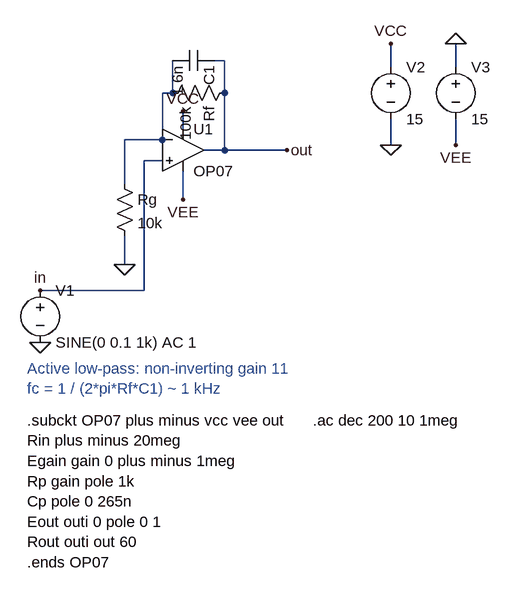
[diagram p0: schematic active_lowpass.asc]
active_lowpass.asc, the LTspice schematic file:
Version 4
SHEET 1 880 760
WIRE 80 480 240 480
WIRE 240 480 240 280
WIRE 240 280 268 280
WIRE 268 248 210 248
WIRE 210 248 210 316
WIRE 210 396 210 440
WIRE 268 248 268 176
WIRE 268 176 284 176
WIRE 284 126 284 176
WIRE 348 126 364 126
WIRE 364 126 364 176
WIRE 364 176 364 264
WIRE 332 264 364 264
WIRE 364 264 460 264
WIRE 300 232 300 204
WIRE 300 296 300 340
WIRE 620 136 620 100
WIRE 620 216 620 256
WIRE 720 136 720 100
WIRE 720 216 720 256
FLAG 80 560 0
FLAG 210 440 0
FLAG 80 480 in
FLAG 460 264 out
FLAG 300 204 VCC
FLAG 300 340 VEE
FLAG 620 100 VCC
FLAG 620 256 0
FLAG 720 100 0
FLAG 720 256 VEE
SYMBOL OpAmps\OP07 300 200 R0
SYMATTR InstName U1
SYMATTR Value OP07
SYMBOL voltage 80 464 R0
SYMATTR InstName V1
SYMATTR Value SINE(0 0.1 1k) AC 1
SYMBOL voltage 620 120 R0
SYMATTR InstName V2
SYMATTR Value 15
SYMBOL voltage 720 120 R0
SYMATTR InstName V3
SYMATTR Value 15
SYMBOL res 380 160 R90
SYMATTR InstName Rf
SYMATTR Value 100k
SYMBOL res 194 300 R0
SYMATTR InstName Rg
SYMATTR Value 10k
SYMBOL cap 348 110 R90
SYMATTR InstName C1
SYMATTR Value 1.6n
TEXT 60 600 Left 2 ;Active low-pass: non-inverting gain 11\nfc = 1 / (2*pi*Rf*C1) ~ 1 kHz
TEXT 60 680 Left 2 !.subckt OP07 plus minus vcc vee out\nRin plus minus 20meg\nEgain gain 0 plus minus 1meg\nRp gain pole 1k\nCp pole 0 265n\nEout outi 0 pole 0 1\nRout outi out 60\n.ends OP07
TEXT 500 680 Left 2 !.ac dec 200 10 1meg

The netlist it stands for:
* active_lowpass.asc
XU1 in N001 VCC VEE out LT1001  ; OP07, pins In+ In- V+ V- OUT
V1 in 0 SINE(0 0.1 1k) AC 1
V2 VCC 0 15
V3 0 VEE 15
Rf out N001 100k
Rg N001 0 10k
C1 out N001 1.6n
* Active low-pass: non-inverting gain 11
* fc = 1 / (2*pi*Rf*C1) ~ 1 kHz
.subckt OP07 plus minus vcc vee out
Rin plus minus 20meg
Egain gain 0 plus minus 1meg
Rp gain pole 1k
Cp pole 0 265n
Eout outi 0 pole 0 1
Rout outi out 60
.ends OP07
.ac dec 200 10 1meg
.lib LTC.lib
.backanno
.end